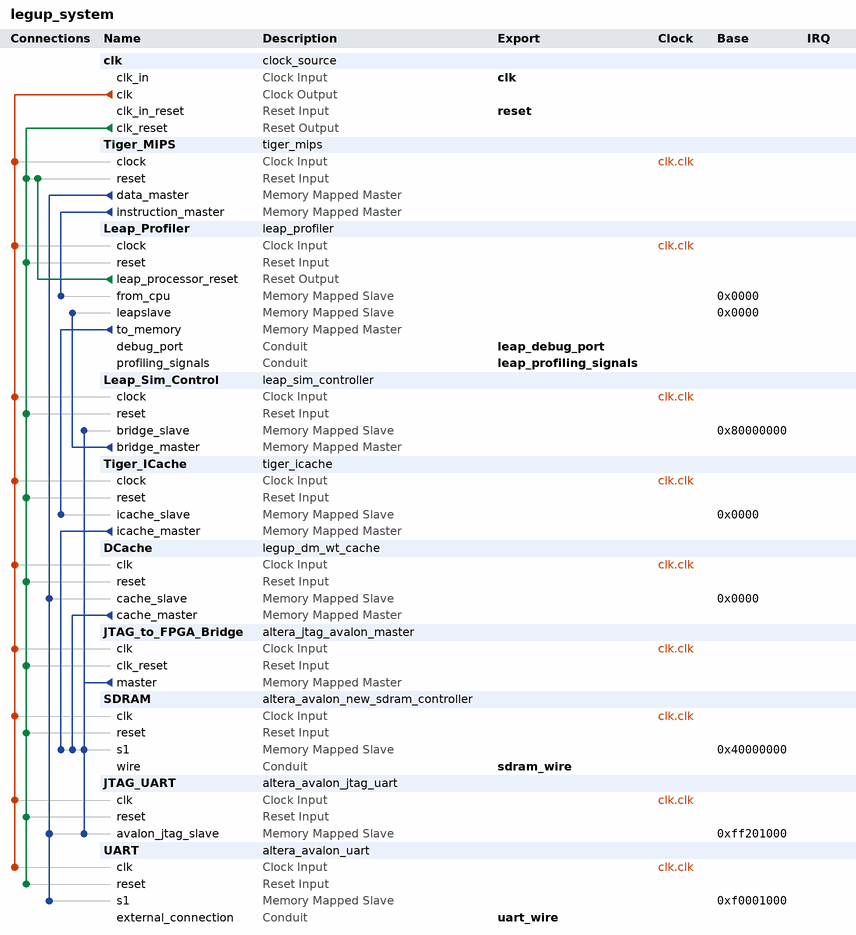
[diagram p0: system contents]
# Platform Designer (Qsys) system legup_system, Cyclone II EP2C35F672C6
# Parameters at their usual value, and those the tool derives, are not listed.
package require -exact qsys 13.0.1.99.2
create_system legup_system
set_project_property DEVICE_FAMILY {Cyclone II}
set_project_property DEVICE EP2C35F672C6

add_instance clk clock_source 13.0
set_instance_parameter_value clk clockFrequency 50000000

add_instance Tiger_MIPS tiger_mips 1.0
set_instance_parameter_value Tiger_MIPS RESET_ADDRESS 1073741824

add_instance Leap_Profiler leap_profiler 1.0
set_instance_parameter_value Leap_Profiler STARTING_PC 1073741856
set_instance_parameter_value Leap_Profiler prof_param_N2 8
set_instance_parameter_value Leap_Profiler prof_param_S2 5
set_instance_parameter_value Leap_Profiler prof_param_CW 32

add_instance Leap_Sim_Control leap_sim_controller 1.0
set_instance_parameter_value Leap_Sim_Control STARTING_PC 1073741856
set_instance_parameter_value Leap_Sim_Control N2 8

add_instance Tiger_ICache tiger_icache 1.0

add_instance DCache legup_dm_wt_cache 1.0

add_instance JTAG_to_FPGA_Bridge altera_jtag_avalon_master 13.0

add_instance SDRAM altera_avalon_new_sdram_controller 13.0.1.99.2
set_instance_parameter_value SDRAM TAC 5.5
set_instance_parameter_value SDRAM TRCD 20.0
set_instance_parameter_value SDRAM TRP 20.0
set_instance_parameter_value SDRAM casLatency 3
set_instance_parameter_value SDRAM columnWidth 8
set_instance_parameter_value SDRAM dataWidth 16
set_instance_parameter_value SDRAM generateSimulationModel true
set_instance_parameter_value SDRAM model single_Micron_MT48LC4M32B2_7_chip
set_instance_parameter_value SDRAM numberOfBanks 4
set_instance_parameter_value SDRAM numberOfChipSelects 1
set_instance_parameter_value SDRAM powerUpDelay 100.0
set_instance_parameter_value SDRAM refreshPeriod 15.625
set_instance_parameter_value SDRAM rowWidth 12

add_instance JTAG_UART altera_avalon_jtag_uart 13.0.1.99.2
set_instance_parameter_value JTAG_UART simInteractiveOptions NO_INTERACTIVE_WINDOWS

add_instance UART altera_avalon_uart 13.0.1.99.2
set_instance_parameter_value UART baud 115200
set_instance_parameter_value UART dataBits 8
set_instance_parameter_value UART fixedBaud true
set_instance_parameter_value UART parity NONE
set_instance_parameter_value UART stopBits 1

# connections
add_connection clk.clk DCache.clk clock
add_connection clk.clk JTAG_to_FPGA_Bridge.clk clock
add_connection clk.clk JTAG_UART.clk clock
add_connection clk.clk Leap_Profiler.clock clock
add_connection clk.clk Leap_Sim_Control.clock clock
add_connection clk.clk SDRAM.clk clock
add_connection clk.clk Tiger_ICache.clock clock
add_connection clk.clk Tiger_MIPS.clock clock
add_connection clk.clk UART.clk clock
add_connection clk.clk_reset DCache.reset reset
add_connection clk.clk_reset JTAG_to_FPGA_Bridge.clk_reset reset
add_connection clk.clk_reset JTAG_UART.reset reset
add_connection clk.clk_reset Leap_Profiler.reset reset
add_connection clk.clk_reset Leap_Sim_Control.reset reset
add_connection clk.clk_reset SDRAM.reset reset
add_connection clk.clk_reset Tiger_ICache.reset reset
add_connection clk.clk_reset Tiger_MIPS.reset reset
add_connection clk.clk_reset UART.reset reset
add_connection Leap_Profiler.leap_processor_reset Tiger_MIPS.reset reset
add_connection DCache.cache_master SDRAM.s1 avalon
set_connection_parameter_value DCache.cache_master/SDRAM.s1 baseAddress 0x40000000
add_connection JTAG_to_FPGA_Bridge.master JTAG_UART.avalon_jtag_slave avalon
set_connection_parameter_value JTAG_to_FPGA_Bridge.master/JTAG_UART.avalon_jtag_slave baseAddress 0xff201000
add_connection JTAG_to_FPGA_Bridge.master Leap_Sim_Control.bridge_slave avalon
set_connection_parameter_value JTAG_to_FPGA_Bridge.master/Leap_Sim_Control.bridge_slave baseAddress 0x80000000
add_connection JTAG_to_FPGA_Bridge.master SDRAM.s1 avalon
set_connection_parameter_value JTAG_to_FPGA_Bridge.master/SDRAM.s1 baseAddress 0x40000000
add_connection Leap_Profiler.to_memory Tiger_ICache.icache_slave avalon
set_connection_parameter_value Leap_Profiler.to_memory/Tiger_ICache.icache_slave baseAddress 0x0000
add_connection Leap_Sim_Control.bridge_master Leap_Profiler.leapslave avalon
set_connection_parameter_value Leap_Sim_Control.bridge_master/Leap_Profiler.leapslave baseAddress 0x0000
add_connection Tiger_ICache.icache_master SDRAM.s1 avalon
set_connection_parameter_value Tiger_ICache.icache_master/SDRAM.s1 baseAddress 0x40000000
add_connection Tiger_MIPS.data_master DCache.cache_slave avalon
set_connection_parameter_value Tiger_MIPS.data_master/DCache.cache_slave baseAddress 0x0000
add_connection Tiger_MIPS.data_master JTAG_UART.avalon_jtag_slave avalon
set_connection_parameter_value Tiger_MIPS.data_master/JTAG_UART.avalon_jtag_slave baseAddress 0xff201000
add_connection Tiger_MIPS.data_master UART.s1 avalon
set_connection_parameter_value Tiger_MIPS.data_master/UART.s1 baseAddress 0xf0001000
add_connection Tiger_MIPS.instruction_master Leap_Profiler.from_cpu avalon
set_connection_parameter_value Tiger_MIPS.instruction_master/Leap_Profiler.from_cpu baseAddress 0x0000

# exported interfaces
add_interface clk clock sink
set_interface_property clk EXPORT_OF clk.clk_in
add_interface reset reset sink
set_interface_property reset EXPORT_OF clk.clk_in_reset
add_interface leap_profiling_signals conduit end
set_interface_property leap_profiling_signals EXPORT_OF Leap_Profiler.profiling_signals
add_interface leap_debug_port conduit end
set_interface_property leap_debug_port EXPORT_OF Leap_Profiler.debug_port
add_interface sdram_wire conduit end
set_interface_property sdram_wire EXPORT_OF SDRAM.wire
add_interface uart_wire conduit end
set_interface_property uart_wire EXPORT_OF UART.external_connection

set_interconnect_requirement {$system} qsys_mm.clockCrossingAdapter HANDSHAKE
set_interconnect_requirement {$system} qsys_mm.maxAdditionalLatency 1

save_system legup_system.qsys
